# Altium schematic sheet Hierarchical_Sheet.SchDoc
size A3; SheetNumber: 1; SheetTotal: 7
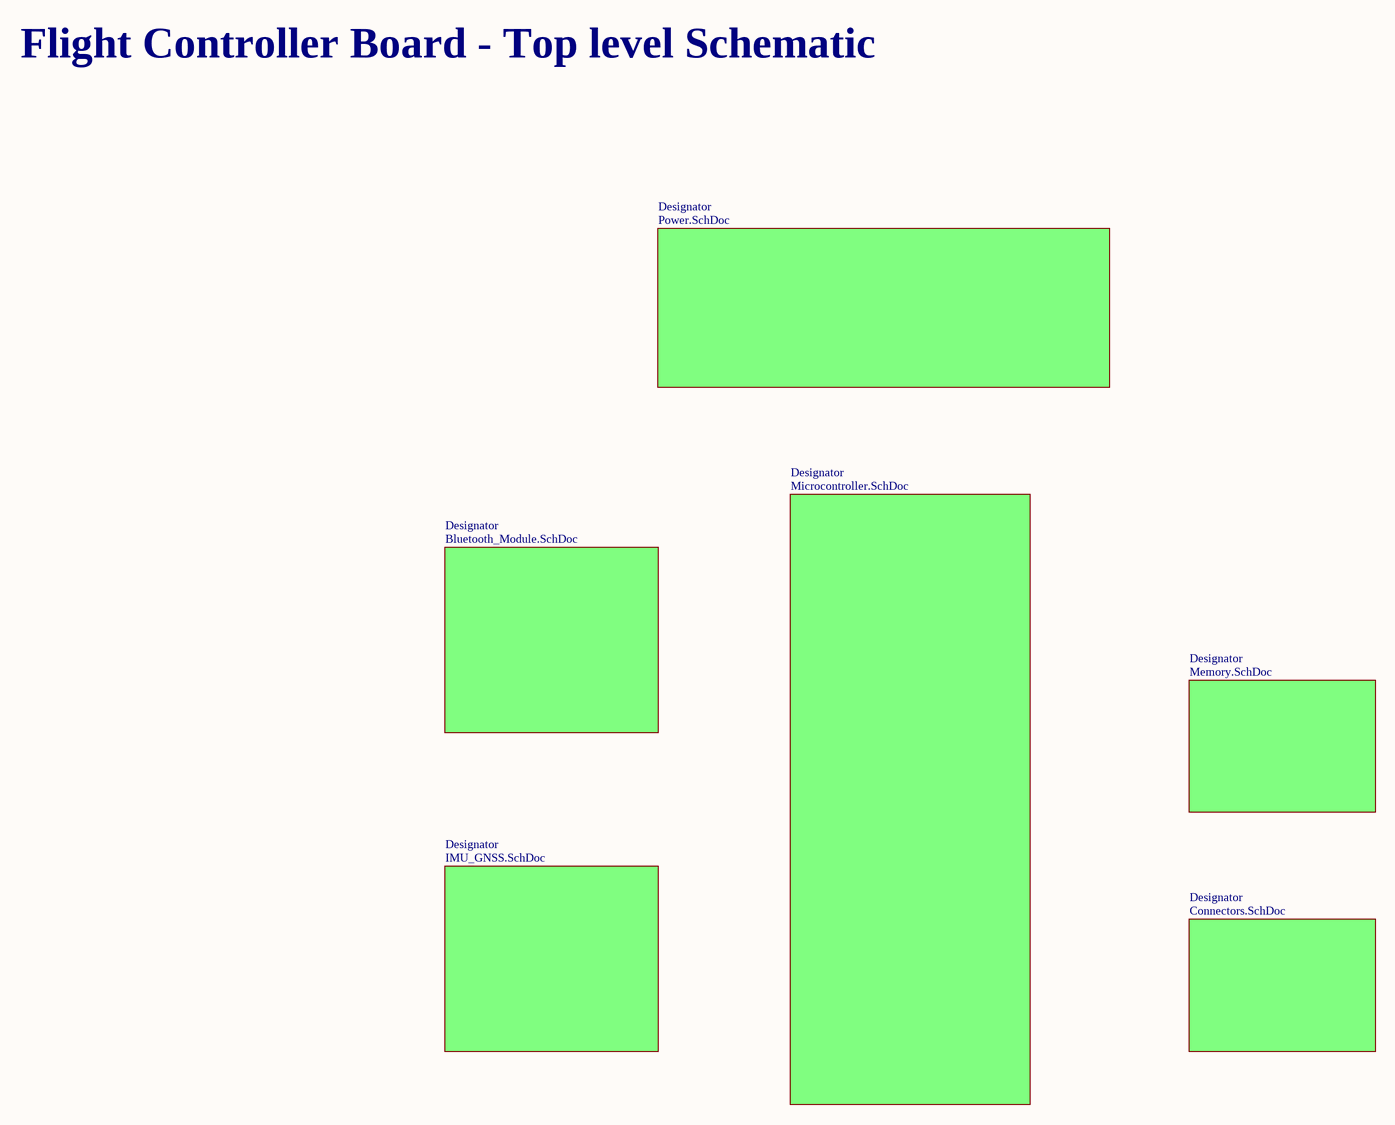
[diagram p0: Hierarchical_Sheet.SchDoc]

## Sub-sheets
Designator = Microcontroller.SchDoc: no entries
Designator = IMU_GNSS.SchDoc: no entries
Designator = Bluetooth_Module.SchDoc: no entries
Designator = Power.SchDoc: no entries
Designator = Connectors.SchDoc: no entries
Designator = Memory.SchDoc: no entries

## Notes on the sheet
- Flight Controller Board - Top level Schematic